# Altium schematic sheet LoRaBoard_1.SchDoc
size 410 x 297 mm; Author: Трембач Д.Н.; DocumentNumber: ABCD.000001.600.Э3; SheetNumber: 1; SheetTotal: 3
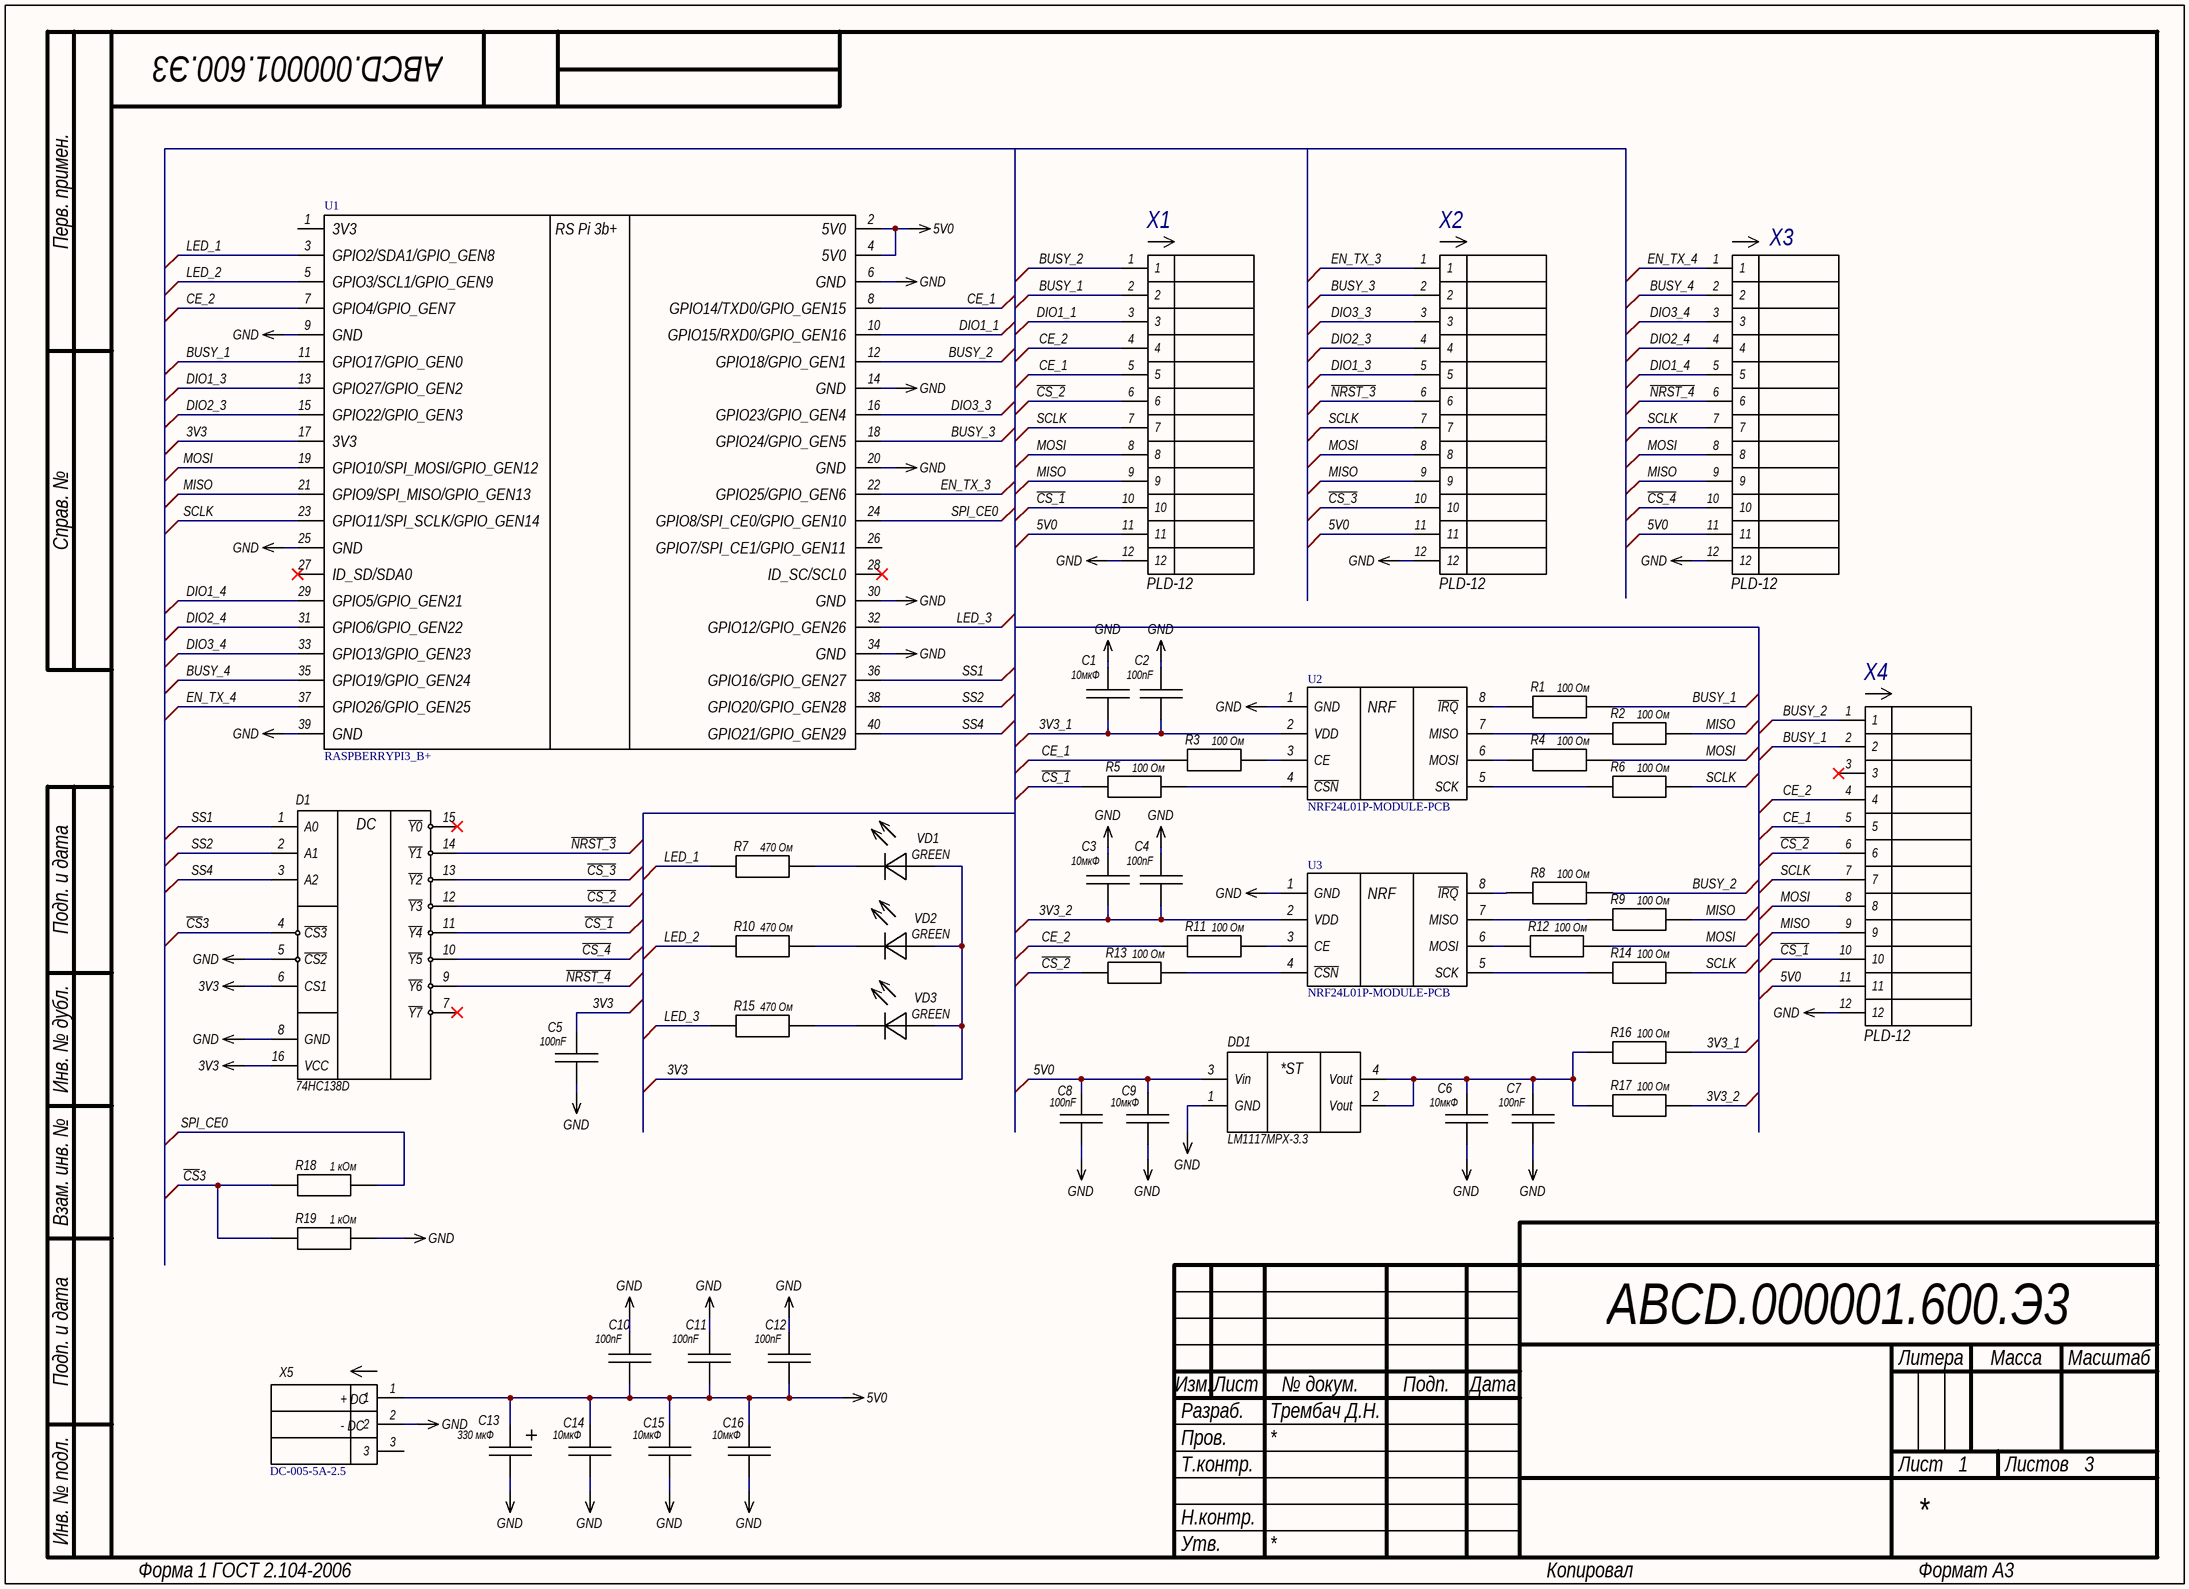
[diagram p0: LoRaBoard_1.SchDoc]

## Parts
C1  10мкФ  [CAP 0805]
C2  100nF  [CAP 0603_1608 RF]
C3  10мкФ  [CAP 0805]
C4  100nF  [CAP 0603_1608 RF]
C5  100nF  [CAP 0603_1608 RF]
C6  10мкФ  [CAP 0805]
C7  100nF  [CAP 0603_1608 RF]
C8  100nF  [CAP 0603_1608 RF]
C9  10мкФ  [CAP 0805]
C10  100nF  [CAP 0603_1608 RF]
C11  100nF  [CAP 0603_1608 RF]
C12  100nF  [CAP 0603_1608 RF]
C13  330 мкФ  [CAP ALSMD ELEC 10.5x10.0 mm]
C14  10мкФ  [CAP 0805]
C15  10мкФ  [CAP 0805]
C16  10мкФ  [CAP 0805]
D1  74HC138D  [SO-16]
DD1  LM1117MPX-3.3  [SOT223]
R1  100 Ом  [RES 0603_1608]
R2  100 Ом  [RES 0603_1608]
R3  100 Ом  [RES 0603_1608]
R4  100 Ом  [RES 0603_1608]
R5  100 Ом  [RES 0603_1608]
R6  100 Ом  [RES 0603_1608]
R7  470 Ом  [RES 0603_1608]
R8  100 Ом  [RES 0603_1608]
R9  100 Ом  [RES 0603_1608]
R10  470 Ом  [RES 0603_1608]
R11  100 Ом  [RES 0603_1608]
R12  100 Ом  [RES 0603_1608]
R13  100 Ом  [RES 0603_1608]
R14  100 Ом  [RES 0603_1608]
R15  470 Ом  [RES 0603_1608]
R16  100 Ом  [RES 0603_1608]
R17  100 Ом  [RES 0603_1608]
R18  1 кОм  [RES 0603_1608]
R19  1 кОм  [RES 0603_1608]
U1  RASPBERRYPI3_B+  [MODULE_RASPBERRYPI3_B+]
U2  NRF24L01P-MODULE-PCB  [NRF24L01P-MODULE]
U3  NRF24L01P-MODULE-PCB  [NRF24L01P-MODULE]
VD1  value GREEN  [LED 0603_1608 GREEN]  (hidden comment: LED SMD GREEN)
VD2  value GREEN  [LED 0603_1608 GREEN]  (hidden comment: LED SMD GREEN)
VD3  value GREEN  [LED 0603_1608 GREEN]  (hidden comment: LED SMD GREEN)
X1  value PLD-12  [PLD_12_elipse]  (hidden comment: PLD-12 (DS1021-2x6))
X2  value PLD-12  [PLD_12_elipse]  (hidden comment: PLD-12 (DS1021-2x6))
X3  value PLD-12  [PLD_12_elipse]  (hidden comment: PLD-12 (DS1021-2x6))
X4  value PLD-12  [PLD_12_elipse]  (hidden comment: PLD-12 (DS1021-2x6))
X5  DC-005-5A-2.5  [DC-005-5A-2.5]

## Nets
3V3: C5.2 D1.6(CS1) D1.16(VCC) U1.17 VD1.1(А) VD2.1(А) VD3.1(А)
5V0: C8.2 C9.2 C10.2 C11.2 C12.2 C13.1 C14.2 C15.2 C16.2 DD1.3(Vin) U1.2 U1.4 X1.11 X2.11 X3.11 X4.11 X5.1
GND: C1.1 C2.1 C3.1 C4.1 C5.1 C6.1 C7.1 C8.1 C9.1 C10.1 C11.1 C12.1 C13.2 C14.1 C15.1 C16.1 D1.5(~{CS2}) D1.8(GND) DD1.1(GND) R19.2 U1.6 U1.9 U1.14 U1.20 U1.25 U1.30 U1.34 U1.39 U2.1(GND) U3.1(GND) X1.12 X2.12 X3.12 X4.12 X5.2
3V3_1: C1.2 C2.2 R16.2 U2.2(VDD)
3V3_2: C3.2 C4.2 R17.2 U3.2(VDD)
~{CS}3: D1.4(~{CS3}) R18.1 R19.1
BUSY_1: R1.2 U1.11 X1.2 X4.2
BUSY_2: R8.2 U1.12 X1.1 X4.1
BUSY_3: U1.18 X2.2
BUSY_4: U1.35 X3.2
~{CS_1}: D1.11(~{Y4}) R5.1 X1.10 X4.10
~{CS_2}: D1.12(~{Y3}) R13.1 X1.6 X4.6
~{CS_3}: D1.13(~{Y2}) X2.10
~{CS_4}: D1.10(~{Y5}) X3.10
CE_1: R3.1 U1.8 X1.5 X4.5
CE_2: R11.1 U1.7 X1.4 X4.4
DIO1_1: U1.10 X1.3
DIO1_3: U1.13 X2.5
DIO1_4: U1.29 X3.5
DIO2_3: U1.15 X2.4
DIO2_4: U1.31 X3.4
DIO3_3: U1.16 X2.3
DIO3_4: U1.33 X3.3
EN_TX_3: U1.22 X2.1
EN_TX_4: U1.37 X3.1
LED_1: R7.1 U1.3
LED_2: R10.1 U1.5
LED_3: R15.1 U1.32
MISO: R2.2 R9.2 U1.21 X1.9 X2.9 X3.9 X4.9
MOSI: R4.2 R12.2 U1.19 X1.8 X2.8 X3.8 X4.8
~{NRST_3}: D1.14(~{Y1}) X2.6
~{NRST_4}: D1.9(~{Y6}) X3.6
SCLK: R6.2 R14.2 U1.23 X1.7 X2.7 X3.7 X4.7
SPI_CE0: R18.2 U1.24
SS1: D1.1(A0) U1.36
SS2: D1.2(A1) U1.38
SS4: D1.3(A2) U1.40
NetC6_2: C6.2 C7.2 DD1.2(Vout) DD1.4(Vout) R16.1 R17.1
NetR1_1: R1.1 U2.8(~{IRQ})
NetR2_1: R2.1 U2.7(MISO)
NetR3_2: R3.2 U2.3(CE)
NetR4_1: R4.1 U2.6(MOSI)
NetR5_2: R5.2 U2.4(~{CSN})
NetR6_1: R6.1 U2.5(SCK)
NetR7_2: R7.2 VD1.2(К)
NetR8_1: R8.1 U3.8(~{IRQ})
NetR9_1: R9.1 U3.7(MISO)
NetR10_2: R10.2 VD2.2(К)
NetR11_2: R11.2 U3.3(CE)
NetR12_1: R12.1 U3.6(MOSI)
NetR13_2: R13.2 U3.4(~{CSN})
NetR14_1: R14.1 U3.5(SCK)
NetR15_2: R15.2 VD3.2(К)

Not connected (* = marked no-connect by the designer): D1 7(~{Y7})* 15(~{Y0})*; U1 1 26 27* 28*; X4 3*; X5 3

## Notes on the sheet
- Перв. примен.
- Справ. №
- Подп. и дата
- Инв. № дубл.
- Взам. инв. №
- Разраб.
- Изм.
- Лист
- № докум.
- Подп.
- Дата
- Литера
- Масса
- Масштаб
- Пров.
- Т.контр.
- Листов
- Инв. № подл.
- Н.контр.
- Утв.
- Форма 1 ГОСТ 2.104-2006
- Копировал
- Формат А3
- (in symbol 74HC138D) DC
- (in symbol DC-005-5A-2.5) + DC; - DC
- (in symbol LM1117MPX-3.3) *ST
- (in symbol NRF24L01P-MODULE-PCB) NRF
- (in symbol RASPBERRYPI3_B+) 3V3; RS Pi 3b+; 5V0; GPIO2/SDA1/GPIO_GEN8; GPIO3/SCL1/GPIO_GEN9; GND; GPIO4/GPIO_GEN7; GPIO14/TXD0/GPIO_GEN15; GPIO15/RXD0/GPIO_GEN16; GPIO17/GPIO_GEN0; GPIO18/GPIO_GEN1; GPIO27/GPIO_GEN2; GPIO22/GPIO_GEN3; GPIO23/GPIO_GEN4; GPIO24/GPIO_GEN5; GPIO10/SPI_MOSI/GPIO_GEN12; GPIO9/SPI_MISO/GPIO_GEN13; GPIO25/GPIO_GEN6; GPIO11/SPI_SCLK/GPIO_GEN14; GPIO8/SPI_CE0/GPIO_GEN10; GPIO7/SPI_CE1/GPIO_GEN11; ID_SD/SDA0; ID_SC/SCL0; GPIO5/GPIO_GEN21; GPIO6/GPIO_GEN22; GPIO12/GPIO_GEN26; GPIO13/GPIO_GEN23; GPIO19/GPIO_GEN24; GPIO16/GPIO_GEN27; GPIO26/GPIO_GEN25; GPIO20/GPIO_GEN28; GPIO21/GPIO_GEN29

## Library data of the parts
C1 C3 C6 C9 C14-C16 = Capacitor: 10мкФ X5R 16В 10% 0805, CC0805KKX5R7BB106; Vendor Code: *; Value: 10мкФ; Part Number: CC0805KKX5R7BB106
C2 C4 C5 C7 C8 C10-C12 = Capacitor: CC0603JPX7R9BB104, 50V 100nF X7R 5% 0603; Vendor Code: *; Value: 100nF; Part Number: CC0603JPX7R9BB104
C13 = CAP ALSMD ELEC: ECAP SMD, 330 мкФ, 35 В, 105°C, 20% 10x10.5мм, JCK1V331M100105; Vendor Code: *; Value: 330 мкФ; Part Number: ECAP SMD, 330 мкФ, 35 В, 105°C, 20% 10x10.5мм, JCK1V331M100105
D1 = 74HC138D: 3-to-8 line decoder/demultiplexer; Vendor Code: *; Value: 74HC138D
DD1 = LM1117MPX-3.3: 800mA Low-Dropout Linear Regulator; Vendor Code: *; Value: LM1117MPX-3.3
R1-R6 R8 R9 R11-R14 R16 R17 = Resistor: 0.1Вт 0603 100 Ом, 5%, RC0603JR-07100RL; Type: Резистор; Vendor Code: *; Value: 100 Ом; Part Number: RC0603JR-07100RL
R7 R10 R15 = Resistor: 0.1Вт 0603 100 Ом, 5%, RC0603JR-07470RL; Type: Резистор; Vendor Code: *; Value: 470 Ом; Part Number: RC0603JR-07470RL
R18 R19 = Resistor: 0.1Вт 0603 1 кОм, 5%, RC0603JR-071KL; Type: Резистор; Vendor Code: *; Value: 1 кОм; Part Number: RC0603JR-071KL
U1 = RASPBERRYPI3_B+: 1.4GHz 64-bit quad-core processor, dual-band wireless LAN, Bluetooth 4.2/BLE, faster Ethernet, and Power-over-Ethernet support (with separate PoE HAT); MF: Raspberry Pi Foundation (NF); Price: None; Availability: Unavailable; Package: None; SnapEDA_Link: https://www.snapeda.com/parts/RASPBERRYPI4%204GB/Raspberry%20Pi/view-part/3832294/?ref=snap; Value: *; MP: RASPBERRYPI3_B+; Vendor Code: *
U2 U3 = NRF24L01P-MODULE-PCB: - Transceiver For Use With nRF24L01+; MF: Nordic Semiconductor; Package: None; MP: NRF24L01P-MODULE-PCB; Value: *; Availability: Bad; Price: None; SnapEDA_Link: https://www.snapeda.com/parts/NRF24L01P-MODULE-PCB/Nordic%20Semiconductor%20ASA/view-part/230534/?ref=snap; Mouser-Purchase-URL: https://snapeda.com/shop?store=Mouser&id=230534
X1-X4 = PLD-12: 2.54mm PIN Header 2X6P Straight Type H=2.5mm Full Gold Flash Plating.; Published: 07.03.2013; Publisher: Andrew Danich; Type: Вилка
X5 = DC-005-5A-2.5: DC Power Receptacle Jack, Through Hole, Right Angle; MP: DC-005-5A-2.5
VD1-VD3 = LED SMD GREEN: Vendor Code: *